# EasyEDA schematic ESP32FC.json
TITLE: Sheet_1; REV: 1.0; Date: 2024-05-06; Sheet: 1/1; Company: ret7020
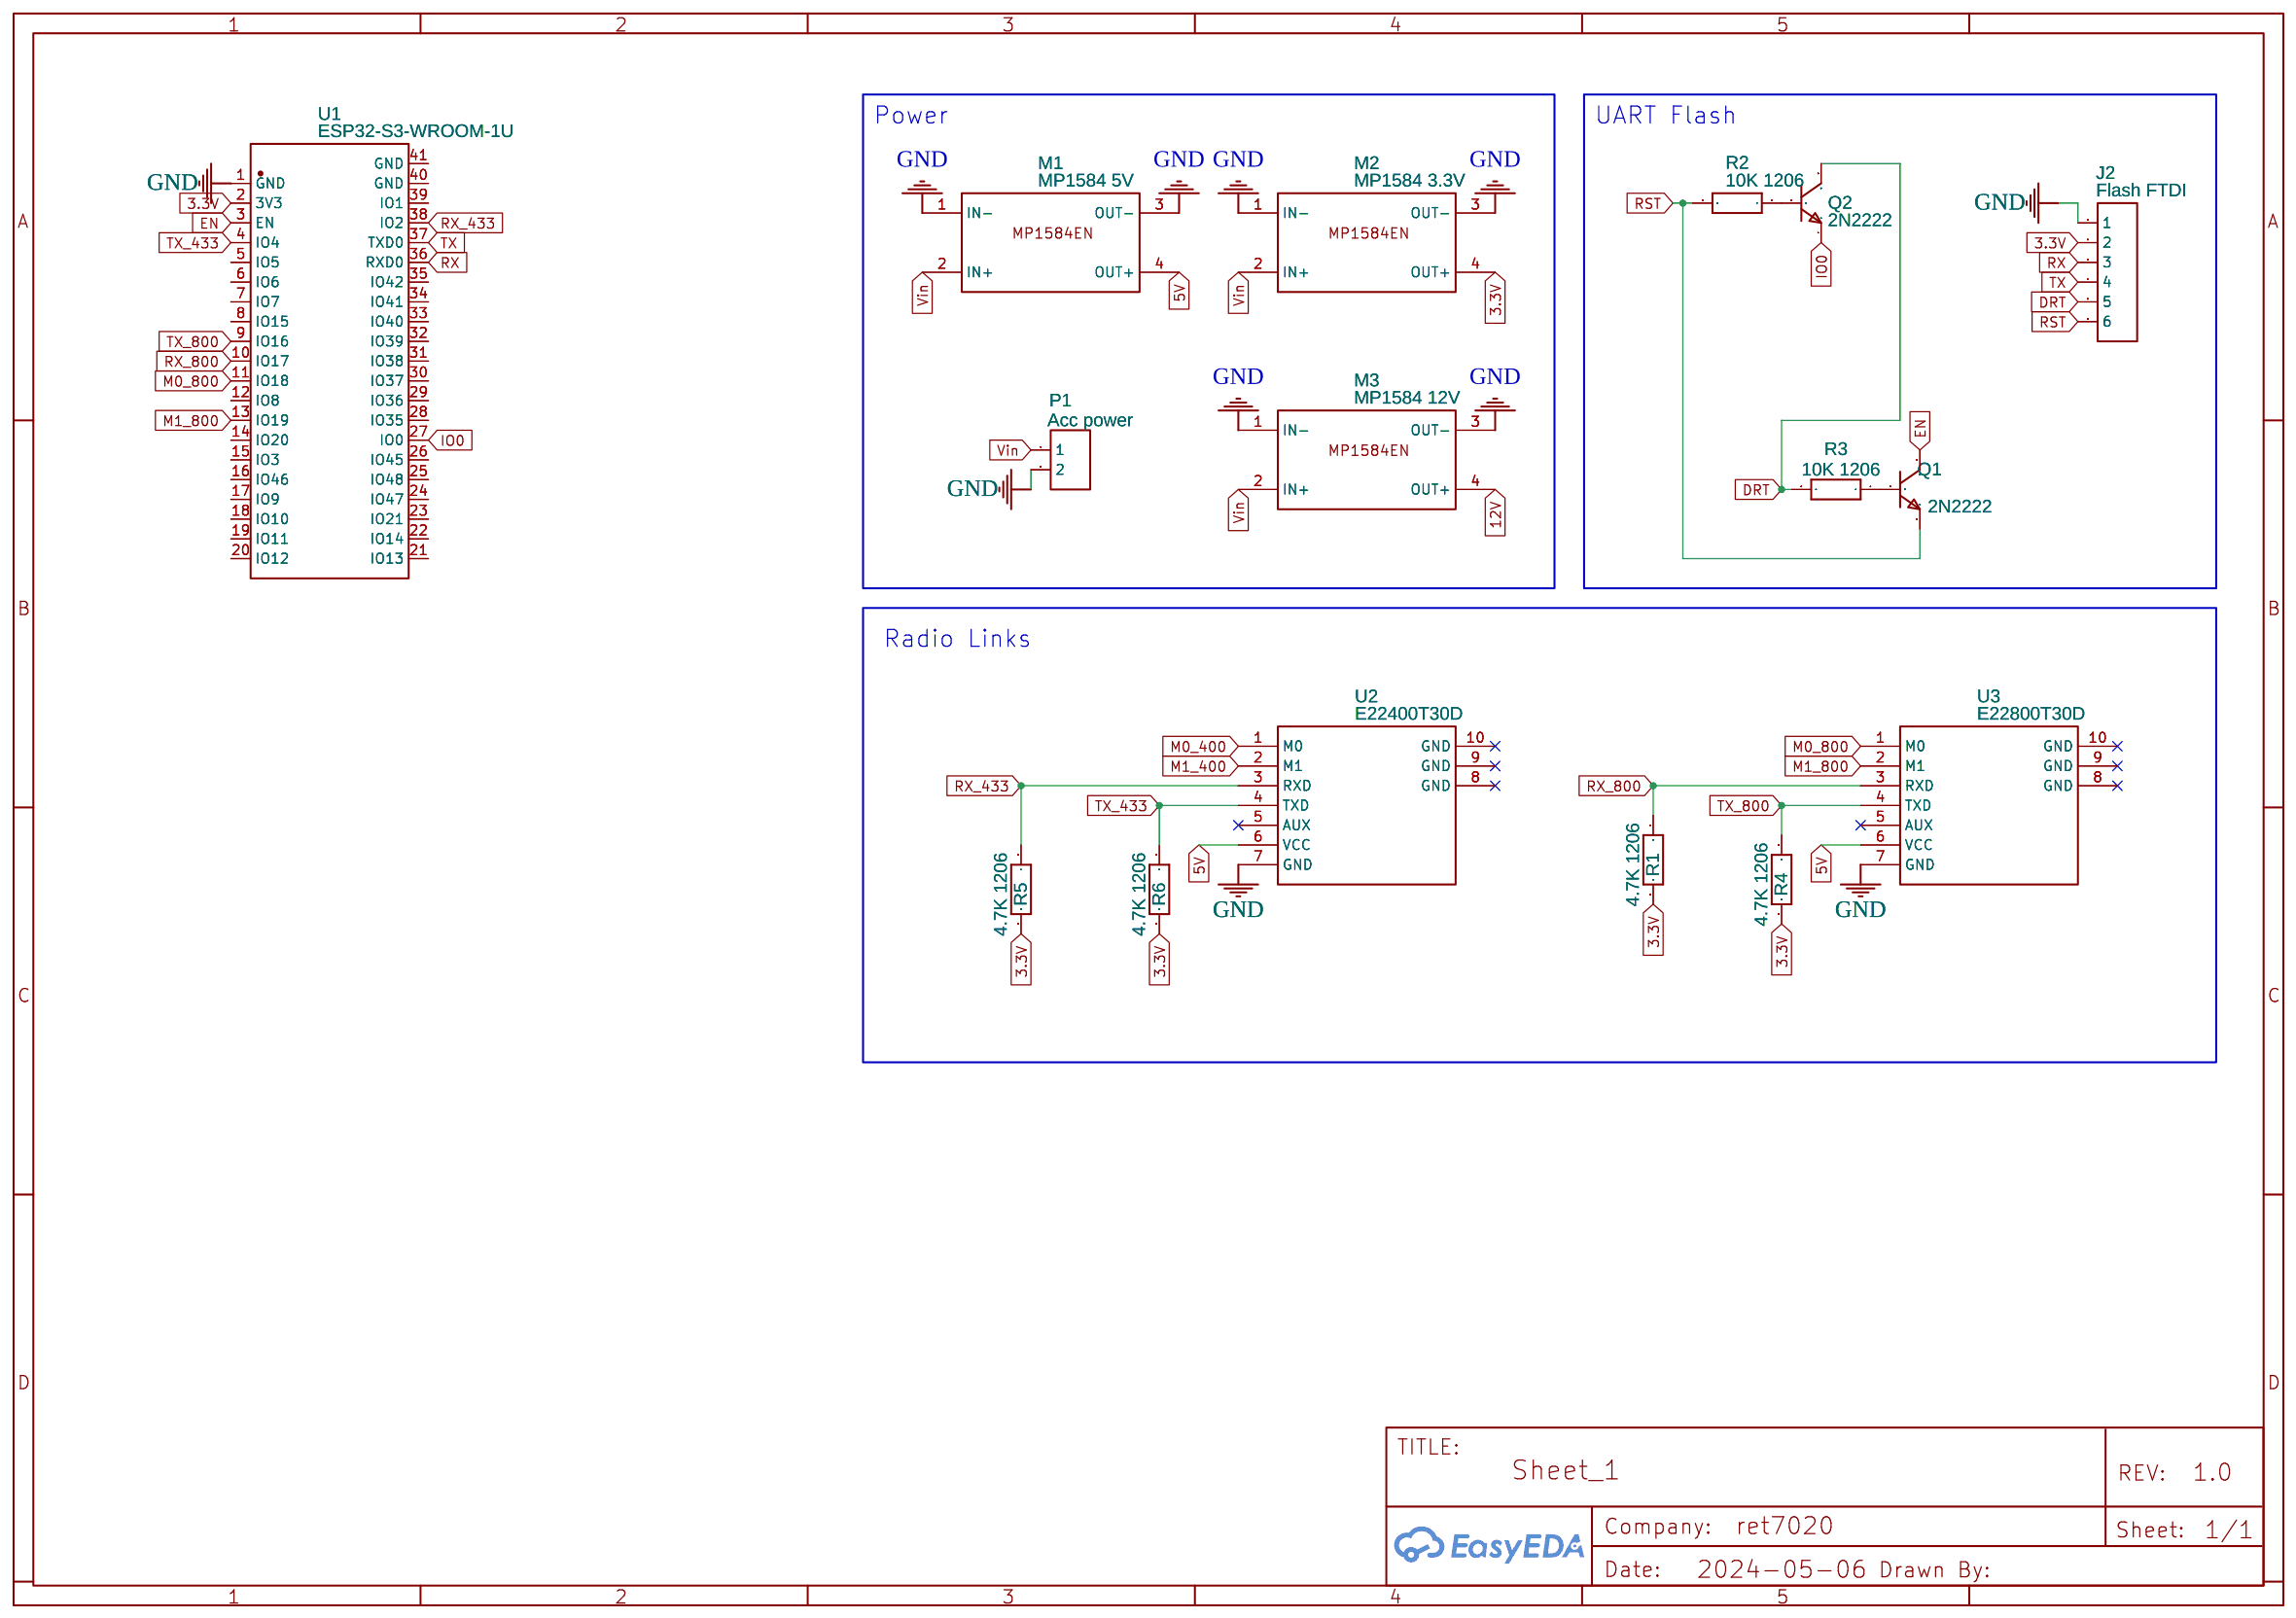
[diagram p0: schematic sheet]

## Parts
J2  Flash FTDI  [HDR-M-2.54_1X6]
M1  MP1584 5V  [MP1584EN-5V]
M2  MP1584 3.3V  [MP1584EN-5V]
M3  MP1584 12V  [MP1584EN-5V]
P1  Acc power  [CONN-TH_2P-P5.08]
Q1  2N2222  [TO-92-3_L4.9-W3.7-P1.27-L]
Q2  2N2222  [TO-92-3_L4.9-W3.7-P1.27-L]
R1  4.7K 1206  [RESISTOR-SMD-1206]
R2  10K 1206  [RESISTOR-SMD-1206]
R3  10K 1206  [RESISTOR-SMD-1206]
R4  4.7K 1206  [RESISTOR-SMD-1206]
R5  4.7K 1206  [RESISTOR-SMD-1206]
R6  4.7K 1206  [RESISTOR-SMD-1206]
U1  ESP32-S3-WROOM-1U  [WIRELM-SMD_ESP32-S3-WROOM-1U]
U2  E22400T30D  [GW-EBYTE-E22-H]
U3  E22800T30D  [GW-EBYTE-E22-H]

## Library data of the parts
J2 = HDR-M-2.54_1x6: Supplier Part: C190819; Supplier: LCSC; Contributor: LCEDA_Lib
M1-M3 = MP1584EN copy: Manufacturer Part: MP1584EN; Contributor: raychelm
P1 = CONN-TH_2P-P5.08: Supplier: LCSC; Contributor: LCEDA_Lib
Q1 Q2 = 2N2222: Contributor: LCSC; Supplier: LCSC; Manufacturer: ST(先科); Manufacturer Part: 2N2222A; Supplier Part: C118536; JLCPCB Part Class: Extended Part; link: https://lcsc.com/eda_search?q=C118536&%26type=1&ref=editor
R1-R6 = Resistor-SMD-1206: Supplier: Banggood; Contributor: WalterHaazen
U1 = ESP32-S3-WROOM-1U: Contributor: lcsc; Supplier: LCSC; Supplier Part: C9900027631; Manufacturer: null; JLCPCB Part Class: Extended Part; link: https://lcsc.com/eda_search?q=C9900027631&%26type=1&ref=editor
U2 U3 = GW-Ebyte-E22400T22D-TTL-LoRa: link: https://atta.szlcsc.com/upload/public/pdf/source/20200421/C518905_D8E5D6CF4048BCDC739E445BB67568CA.pdf

## Nets
3.3V: J2.2 M2.4(OUT+) R1.2 R4.2 R5.2 R6.2 U1.2(3V3)
5V: M1.4(OUT+) U2.6(VCC) U3.6(VCC)
12V: M3.4(OUT+)
GND: J2.1 M1.1(IN-) M1.3(OUT-) M2.1(IN-) M2.3(OUT-) M3.1(IN-) M3.3(OUT-) P1.2 U1.1(GND) U2.7(GND) U3.7(GND)
Vin: M1.2(IN+) M2.2(IN+) M3.2(IN+) P1.1
DRT: J2.5 Q2.3(C) R3.2
EN: Q1.3(C) U1.3(EN)
IO0: Q2.1(E) U1.27(IO0)
M0_400: U2.1(M0)
M0_800: U1.11(IO18) U3.1(M0)
M1_400: U2.2(M1)
M1_800: U1.13(IO19) U3.2(M1)
RST: J2.6 Q1.1(E) R2.2
RX: J2.3 U1.36(RXD0)
RX_433: R5.1 U1.38(IO2) U2.3(RXD)
RX_800: R1.1 U1.10(IO17) U3.3(RXD)
TX: J2.4 U1.37(TXD0)
TX_433: R6.1 U1.4(IO4) U2.4(TXD)
TX_800: R4.1 U1.9(IO16) U3.4(TXD)
Net-(Q1-2): Q1.2(B) R3.1
Net-(Q2-2): Q2.2(B) R2.1

Not connected (* = marked no-connect by the designer): U1 5(IO5) 6(IO6) 7(IO7) 8(IO15) 12(IO8) 14(IO20) 15(IO3) 16(IO46) 17(IO9) 18(IO10) 19(IO11) 20(IO12) 21(IO13) 22(IO14) 23(IO21) 24(IO47) 25(IO48) 26(IO45) 28(IO35) 29(IO36) 30(IO37) 31(IO38) 32(IO39) 33(IO40) 34(IO41) 35(IO42) 39(IO1) 40(GND) 41(GND); U2 5(AUX)* 8(GND)* 9(GND)* 10(GND)*; U3 5(AUX)* 8(GND)* 9(GND)* 10(GND)*

## Notes on the sheet
- Power
- UART Flash
- Radio Links
